# EAGLE design bridge-1A (EAGLE 7.7.0)

## Sheet 1 of 2
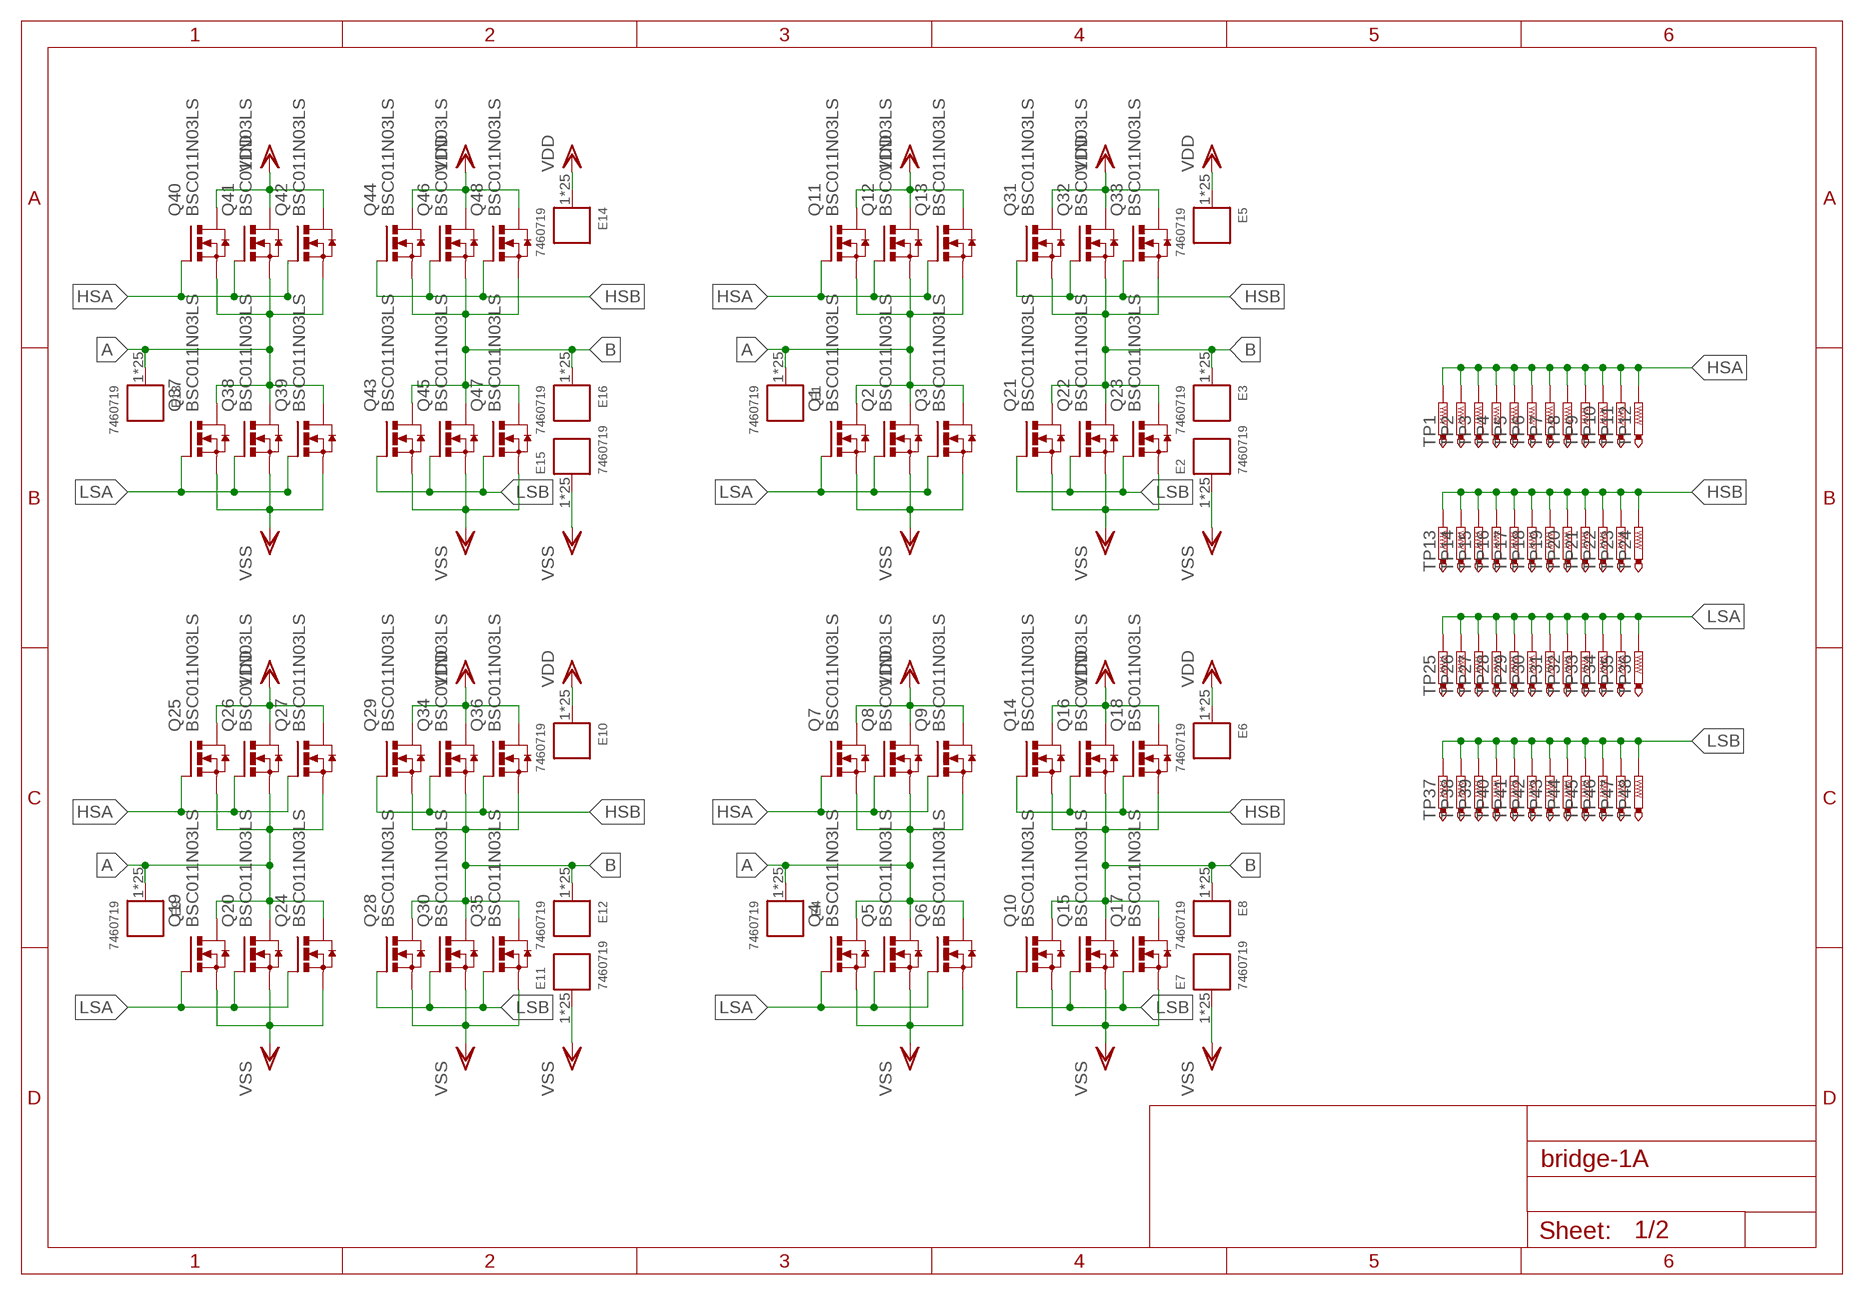
[diagram p0: schematic, sheet 1]

### Parts
E1  7460719  WP-SHFU_K(HAL)  [25PINS_FULL_HAL]
E2  7460719  WP-SHFU_K(HAL)  [25PINS_FULL_HAL]
E3  7460719  WP-SHFU_K(HAL)  [25PINS_FULL_HAL]
E4  7460719  WP-SHFU_K(HAL)  [25PINS_FULL_HAL]
E5  7460719  WP-SHFU_K(HAL)  [25PINS_FULL_HAL]
E6  7460719  WP-SHFU_K(HAL)  [25PINS_FULL_HAL]
E7  7460719  WP-SHFU_K(HAL)  [25PINS_FULL_HAL]
E8  7460719  WP-SHFU_K(HAL)  [25PINS_FULL_HAL]
E9  7460719  WP-SHFU_K(HAL)  [25PINS_FULL_HAL]
E10  7460719  WP-SHFU_K(HAL)  [25PINS_FULL_HAL]
E11  7460719  WP-SHFU_K(HAL)  [25PINS_FULL_HAL]
E12  7460719  WP-SHFU_K(HAL)  [25PINS_FULL_HAL]
E13  7460719  WP-SHFU_K(HAL)  [25PINS_FULL_HAL]
E14  7460719  WP-SHFU_K(HAL)  [25PINS_FULL_HAL]
E15  7460719  WP-SHFU_K(HAL)  [25PINS_FULL_HAL]
E16  7460719  WP-SHFU_K(HAL)  [25PINS_FULL_HAL]
Q1  BSC011N03LS  [PG-TDSON-8]
Q2  BSC011N03LS  [PG-TDSON-8]
Q3  BSC011N03LS  [PG-TDSON-8]
Q4  BSC011N03LS  [PG-TDSON-8]
Q5  BSC011N03LS  [PG-TDSON-8]
Q6  BSC011N03LS  [PG-TDSON-8]
Q7  BSC011N03LS  [PG-TDSON-8]
Q8  BSC011N03LS  [PG-TDSON-8]
Q9  BSC011N03LS  [PG-TDSON-8]
Q10  BSC011N03LS  [PG-TDSON-8]
Q11  BSC011N03LS  [PG-TDSON-8]
Q12  BSC011N03LS  [PG-TDSON-8]
Q13  BSC011N03LS  [PG-TDSON-8]
Q14  BSC011N03LS  [PG-TDSON-8]
Q15  BSC011N03LS  [PG-TDSON-8]
Q16  BSC011N03LS  [PG-TDSON-8]
Q17  BSC011N03LS  [PG-TDSON-8]
Q18  BSC011N03LS  [PG-TDSON-8]
Q19  BSC011N03LS  [PG-TDSON-8]
Q20  BSC011N03LS  [PG-TDSON-8]
Q21  BSC011N03LS  [PG-TDSON-8]
Q22  BSC011N03LS  [PG-TDSON-8]
Q23  BSC011N03LS  [PG-TDSON-8]
Q24  BSC011N03LS  [PG-TDSON-8]
Q25  BSC011N03LS  [PG-TDSON-8]
Q26  BSC011N03LS  [PG-TDSON-8]
Q27  BSC011N03LS  [PG-TDSON-8]
Q28  BSC011N03LS  [PG-TDSON-8]
Q29  BSC011N03LS  [PG-TDSON-8]
Q30  BSC011N03LS  [PG-TDSON-8]
Q31  BSC011N03LS  [PG-TDSON-8]
Q32  BSC011N03LS  [PG-TDSON-8]
Q33  BSC011N03LS  [PG-TDSON-8]
Q34  BSC011N03LS  [PG-TDSON-8]
Q35  BSC011N03LS  [PG-TDSON-8]
Q36  BSC011N03LS  [PG-TDSON-8]
Q37  BSC011N03LS  [PG-TDSON-8]
Q38  BSC011N03LS  [PG-TDSON-8]
Q39  BSC011N03LS  [PG-TDSON-8]
Q40  BSC011N03LS  [PG-TDSON-8]
Q41  BSC011N03LS  [PG-TDSON-8]
Q42  BSC011N03LS  [PG-TDSON-8]
Q43  BSC011N03LS  [PG-TDSON-8]
Q44  BSC011N03LS  [PG-TDSON-8]
Q45  BSC011N03LS  [PG-TDSON-8]
Q46  BSC011N03LS  [PG-TDSON-8]
Q47  BSC011N03LS  [PG-TDSON-8]
Q48  BSC011N03LS  [PG-TDSON-8]
TP1  PTR1TP12SQ  [TP12SQ]
TP2  PTR1TP12SQ  [TP12SQ]
TP3  PTR1TP12SQ  [TP12SQ]
TP4  PTR1TP12SQ  [TP12SQ]
TP5  PTR1TP12SQ  [TP12SQ]
TP6  PTR1TP12SQ  [TP12SQ]
TP7  PTR1TP12SQ  [TP12SQ]
TP8  PTR1TP12SQ  [TP12SQ]
TP9  PTR1TP12SQ  [TP12SQ]
TP10  PTR1TP12SQ  [TP12SQ]
TP11  PTR1TP12SQ  [TP12SQ]
TP12  PTR1TP12SQ  [TP12SQ]
TP13  PTR1TP12SQ  [TP12SQ]
TP14  PTR1TP12SQ  [TP12SQ]
TP15  PTR1TP12SQ  [TP12SQ]
TP16  PTR1TP12SQ  [TP12SQ]
TP17  PTR1TP12SQ  [TP12SQ]
TP18  PTR1TP12SQ  [TP12SQ]
TP19  PTR1TP12SQ  [TP12SQ]
TP20  PTR1TP12SQ  [TP12SQ]
TP21  PTR1TP12SQ  [TP12SQ]
TP22  PTR1TP12SQ  [TP12SQ]
TP23  PTR1TP12SQ  [TP12SQ]
TP24  PTR1TP12SQ  [TP12SQ]
TP25  PTR1TP12SQ  [TP12SQ]
TP26  PTR1TP12SQ  [TP12SQ]
TP27  PTR1TP12SQ  [TP12SQ]
TP28  PTR1TP12SQ  [TP12SQ]
TP29  PTR1TP12SQ  [TP12SQ]
TP30  PTR1TP12SQ  [TP12SQ]
TP31  PTR1TP12SQ  [TP12SQ]
TP32  PTR1TP12SQ  [TP12SQ]
TP33  PTR1TP12SQ  [TP12SQ]
TP34  PTR1TP12SQ  [TP12SQ]
TP35  PTR1TP12SQ  [TP12SQ]
TP36  PTR1TP12SQ  [TP12SQ]
TP37  PTR1TP12SQ  [TP12SQ]
TP38  PTR1TP12SQ  [TP12SQ]
TP39  PTR1TP12SQ  [TP12SQ]
TP40  PTR1TP12SQ  [TP12SQ]
TP41  PTR1TP12SQ  [TP12SQ]
TP42  PTR1TP12SQ  [TP12SQ]
TP43  PTR1TP12SQ  [TP12SQ]
TP44  PTR1TP12SQ  [TP12SQ]
TP45  PTR1TP12SQ  [TP12SQ]
TP46  PTR1TP12SQ  [TP12SQ]
TP47  PTR1TP12SQ  [TP12SQ]
TP48  PTR1TP12SQ  [TP12SQ]

### Nets
A: E1.1 E1.2 E1.3 E1.4 E1.5 E1.6 E1.7 E1.8 E1.9 E1.10 E1.11 E1.12 E1.13 E1.14 E1.15 E1.16 E1.17 E1.18 E1.19 E1.20 E1.21 E1.22 E1.23 E1.24 E1.25 E4.1 E4.2 E4.3 E4.4 E4.5 E4.6 E4.7 E4.8 E4.9 E4.10 E4.11 E4.12 E4.13 E4.14 E4.15 E4.16 E4.17 E4.18 E4.19 E4.20 E4.21 E4.22 E4.23 E4.24 E4.25 E9.1 E9.2 E9.3 E9.4 E9.5 E9.6 E9.7 E9.8 E9.9 E9.10 E9.11 E9.12 E9.13 E9.14 E9.15 E9.16 E9.17 E9.18 E9.19 E9.20 E9.21 E9.22 E9.23 E9.24 E9.25 E13.1 E13.2 E13.3 E13.4 E13.5 E13.6 E13.7 E13.8 E13.9 E13.10 E13.11 E13.12 E13.13 E13.14 E13.15 E13.16 E13.17 E13.18 E13.19 E13.20 E13.21 E13.22 E13.23 E13.24 E13.25 Q1.5(D) Q1.6(D) Q1.7(D) Q1.8(D) Q1.TH(D) Q2.5(D) Q2.6(D) Q2.7(D) Q2.8(D) Q2.TH(D) Q3.5(D) Q3.6(D) Q3.7(D) Q3.8(D) Q3.TH(D) Q4.5(D) Q4.6(D) Q4.7(D) Q4.8(D) Q4.TH(D) Q5.5(D) Q5.6(D) Q5.7(D) Q5.8(D) Q5.TH(D) Q6.5(D) Q6.6(D) Q6.7(D) Q6.8(D) Q6.TH(D) Q7.1(S) Q7.2(S) Q7.3(S) Q8.1(S) Q8.2(S) Q8.3(S) Q9.1(S) Q9.2(S) Q9.3(S) Q11.1(S) Q11.2(S) Q11.3(S) Q12.1(S) Q12.2(S) Q12.3(S) Q13.1(S) Q13.2(S) Q13.3(S) Q19.5(D) Q19.6(D) Q19.7(D) Q19.8(D) Q19.TH(D) Q20.5(D) Q20.6(D) Q20.7(D) Q20.8(D) Q20.TH(D) Q24.5(D) Q24.6(D) Q24.7(D) Q24.8(D) Q24.TH(D) Q25.1(S) Q25.2(S) Q25.3(S) Q26.1(S) Q26.2(S) Q26.3(S) Q27.1(S) Q27.2(S) Q27.3(S) Q37.5(D) Q37.6(D) Q37.7(D) Q37.8(D) Q37.TH(D) Q38.5(D) Q38.6(D) Q38.7(D) Q38.8(D) Q38.TH(D) Q39.5(D) Q39.6(D) Q39.7(D) Q39.8(D) Q39.TH(D) Q40.1(S) Q40.2(S) Q40.3(S) Q41.1(S) Q41.2(S) Q41.3(S) Q42.1(S) Q42.2(S) Q42.3(S)
B: E3.1 E3.2 E3.3 E3.4 E3.5 E3.6 E3.7 E3.8 E3.9 E3.10 E3.11 E3.12 E3.13 E3.14 E3.15 E3.16 E3.17 E3.18 E3.19 E3.20 E3.21 E3.22 E3.23 E3.24 E3.25 E8.1 E8.2 E8.3 E8.4 E8.5 E8.6 E8.7 E8.8 E8.9 E8.10 E8.11 E8.12 E8.13 E8.14 E8.15 E8.16 E8.17 E8.18 E8.19 E8.20 E8.21 E8.22 E8.23 E8.24 E8.25 E12.1 E12.2 E12.3 E12.4 E12.5 E12.6 E12.7 E12.8 E12.9 E12.10 E12.11 E12.12 E12.13 E12.14 E12.15 E12.16 E12.17 E12.18 E12.19 E12.20 E12.21 E12.22 E12.23 E12.24 E12.25 E16.1 E16.2 E16.3 E16.4 E16.5 E16.6 E16.7 E16.8 E16.9 E16.10 E16.11 E16.12 E16.13 E16.14 E16.15 E16.16 E16.17 E16.18 E16.19 E16.20 E16.21 E16.22 E16.23 E16.24 E16.25 Q10.5(D) Q10.6(D) Q10.7(D) Q10.8(D) Q10.TH(D) Q14.1(S) Q14.2(S) Q14.3(S) Q15.5(D) Q15.6(D) Q15.7(D) Q15.8(D) Q15.TH(D) Q16.1(S) Q16.2(S) Q16.3(S) Q17.5(D) Q17.6(D) Q17.7(D) Q17.8(D) Q17.TH(D) Q18.1(S) Q18.2(S) Q18.3(S) Q21.5(D) Q21.6(D) Q21.7(D) Q21.8(D) Q21.TH(D) Q22.5(D) Q22.6(D) Q22.7(D) Q22.8(D) Q22.TH(D) Q23.5(D) Q23.6(D) Q23.7(D) Q23.8(D) Q23.TH(D) Q28.5(D) Q28.6(D) Q28.7(D) Q28.8(D) Q28.TH(D) Q29.1(S) Q29.2(S) Q29.3(S) Q30.5(D) Q30.6(D) Q30.7(D) Q30.8(D) Q30.TH(D) Q31.1(S) Q31.2(S) Q31.3(S) Q32.1(S) Q32.2(S) Q32.3(S) Q33.1(S) Q33.2(S) Q33.3(S) Q34.1(S) Q34.2(S) Q34.3(S) Q35.5(D) Q35.6(D) Q35.7(D) Q35.8(D) Q35.TH(D) Q36.1(S) Q36.2(S) Q36.3(S) Q43.5(D) Q43.6(D) Q43.7(D) Q43.8(D) Q43.TH(D) Q44.1(S) Q44.2(S) Q44.3(S) Q45.5(D) Q45.6(D) Q45.7(D) Q45.8(D) Q45.TH(D) Q46.1(S) Q46.2(S) Q46.3(S) Q47.5(D) Q47.6(D) Q47.7(D) Q47.8(D) Q47.TH(D) Q48.1(S) Q48.2(S) Q48.3(S)
HSA: Q7.4(G) Q8.4(G) Q9.4(G) Q11.4(G) Q12.4(G) Q13.4(G) Q25.4(G) Q26.4(G) Q27.4(G) Q40.4(G) Q41.4(G) Q42.4(G) TP1.TP TP2.TP TP3.TP TP4.TP TP5.TP TP6.TP TP7.TP TP8.TP TP9.TP TP10.TP TP11.TP TP12.TP
HSB: Q14.4(G) Q16.4(G) Q18.4(G) Q29.4(G) Q31.4(G) Q32.4(G) Q33.4(G) Q34.4(G) Q36.4(G) Q44.4(G) Q46.4(G) Q48.4(G) TP13.TP TP14.TP TP15.TP TP16.TP TP17.TP TP18.TP TP19.TP TP20.TP TP21.TP TP22.TP TP23.TP TP24.TP
LSA: Q1.4(G) Q2.4(G) Q3.4(G) Q4.4(G) Q5.4(G) Q6.4(G) Q19.4(G) Q20.4(G) Q24.4(G) Q37.4(G) Q38.4(G) Q39.4(G) TP25.TP TP26.TP TP27.TP TP28.TP TP29.TP TP30.TP TP31.TP TP32.TP TP33.TP TP34.TP TP35.TP TP36.TP
LSB: Q10.4(G) Q15.4(G) Q17.4(G) Q21.4(G) Q22.4(G) Q23.4(G) Q28.4(G) Q30.4(G) Q35.4(G) Q43.4(G) Q45.4(G) Q47.4(G) TP37.TP TP38.TP TP39.TP TP40.TP TP41.TP TP42.TP TP43.TP TP44.TP TP45.TP TP46.TP TP47.TP TP48.TP
VDD: E5.1 E5.2 E5.3 E5.4 E5.5 E5.6 E5.7 E5.8 E5.9 E5.10 E5.11 E5.12 E5.13 E5.14 E5.15 E5.16 E5.17 E5.18 E5.19 E5.20 E5.21 E5.22 E5.23 E5.24 E5.25 E6.1 E6.2 E6.3 E6.4 E6.5 E6.6 E6.7 E6.8 E6.9 E6.10 E6.11 E6.12 E6.13 E6.14 E6.15 E6.16 E6.17 E6.18 E6.19 E6.20 E6.21 E6.22 E6.23 E6.24 E6.25 E10.1 E10.2 E10.3 E10.4 E10.5 E10.6 E10.7 E10.8 E10.9 E10.10 E10.11 E10.12 E10.13 E10.14 E10.15 E10.16 E10.17 E10.18 E10.19 E10.20 E10.21 E10.22 E10.23 E10.24 E10.25 E14.1 E14.2 E14.3 E14.4 E14.5 E14.6 E14.7 E14.8 E14.9 E14.10 E14.11 E14.12 E14.13 E14.14 E14.15 E14.16 E14.17 E14.18 E14.19 E14.20 E14.21 E14.22 E14.23 E14.24 E14.25 Q7.5(D) Q7.6(D) Q7.7(D) Q7.8(D) Q7.TH(D) Q8.5(D) Q8.6(D) Q8.7(D) Q8.8(D) Q8.TH(D) Q9.5(D) Q9.6(D) Q9.7(D) Q9.8(D) Q9.TH(D) Q11.5(D) Q11.6(D) Q11.7(D) Q11.8(D) Q11.TH(D) Q12.5(D) Q12.6(D) Q12.7(D) Q12.8(D) Q12.TH(D) Q13.5(D) Q13.6(D) Q13.7(D) Q13.8(D) Q13.TH(D) Q14.5(D) Q14.6(D) Q14.7(D) Q14.8(D) Q14.TH(D) Q16.5(D) Q16.6(D) Q16.7(D) Q16.8(D) Q16.TH(D) Q18.5(D) Q18.6(D) Q18.7(D) Q18.8(D) Q18.TH(D) Q25.5(D) Q25.6(D) Q25.7(D) Q25.8(D) Q25.TH(D) Q26.5(D) Q26.6(D) Q26.7(D) Q26.8(D) Q26.TH(D) Q27.5(D) Q27.6(D) Q27.7(D) Q27.8(D) Q27.TH(D) Q29.5(D) Q29.6(D) Q29.7(D) Q29.8(D) Q29.TH(D) Q31.5(D) Q31.6(D) Q31.7(D) Q31.8(D) Q31.TH(D) Q32.5(D) Q32.6(D) Q32.7(D) Q32.8(D) Q32.TH(D) Q33.5(D) Q33.6(D) Q33.7(D) Q33.8(D) Q33.TH(D) Q34.5(D) Q34.6(D) Q34.7(D) Q34.8(D) Q34.TH(D) Q36.5(D) Q36.6(D) Q36.7(D) Q36.8(D) Q36.TH(D) Q40.5(D) Q40.6(D) Q40.7(D) Q40.8(D) Q40.TH(D) Q41.5(D) Q41.6(D) Q41.7(D) Q41.8(D) Q41.TH(D) Q42.5(D) Q42.6(D) Q42.7(D) Q42.8(D) Q42.TH(D) Q44.5(D) Q44.6(D) Q44.7(D) Q44.8(D) Q44.TH(D) Q46.5(D) Q46.6(D) Q46.7(D) Q46.8(D) Q46.TH(D) Q48.5(D) Q48.6(D) Q48.7(D) Q48.8(D) Q48.TH(D)
VSS: E2.1 E2.2 E2.3 E2.4 E2.5 E2.6 E2.7 E2.8 E2.9 E2.10 E2.11 E2.12 E2.13 E2.14 E2.15 E2.16 E2.17 E2.18 E2.19 E2.20 E2.21 E2.22 E2.23 E2.24 E2.25 E7.1 E7.2 E7.3 E7.4 E7.5 E7.6 E7.7 E7.8 E7.9 E7.10 E7.11 E7.12 E7.13 E7.14 E7.15 E7.16 E7.17 E7.18 E7.19 E7.20 E7.21 E7.22 E7.23 E7.24 E7.25 E11.1 E11.2 E11.3 E11.4 E11.5 E11.6 E11.7 E11.8 E11.9 E11.10 E11.11 E11.12 E11.13 E11.14 E11.15 E11.16 E11.17 E11.18 E11.19 E11.20 E11.21 E11.22 E11.23 E11.24 E11.25 E15.1 E15.2 E15.3 E15.4 E15.5 E15.6 E15.7 E15.8 E15.9 E15.10 E15.11 E15.12 E15.13 E15.14 E15.15 E15.16 E15.17 E15.18 E15.19 E15.20 E15.21 E15.22 E15.23 E15.24 E15.25 Q1.1(S) Q1.2(S) Q1.3(S) Q2.1(S) Q2.2(S) Q2.3(S) Q3.1(S) Q3.2(S) Q3.3(S) Q4.1(S) Q4.2(S) Q4.3(S) Q5.1(S) Q5.2(S) Q5.3(S) Q6.1(S) Q6.2(S) Q6.3(S) Q10.1(S) Q10.2(S) Q10.3(S) Q15.1(S) Q15.2(S) Q15.3(S) Q17.1(S) Q17.2(S) Q17.3(S) Q19.1(S) Q19.2(S) Q19.3(S) Q20.1(S) Q20.2(S) Q20.3(S) Q21.1(S) Q21.2(S) Q21.3(S) Q22.1(S) Q22.2(S) Q22.3(S) Q23.1(S) Q23.2(S) Q23.3(S) Q24.1(S) Q24.2(S) Q24.3(S) Q28.1(S) Q28.2(S) Q28.3(S) Q30.1(S) Q30.2(S) Q30.3(S) Q35.1(S) Q35.2(S) Q35.3(S) Q37.1(S) Q37.2(S) Q37.3(S) Q38.1(S) Q38.2(S) Q38.3(S) Q39.1(S) Q39.2(S) Q39.3(S) Q43.1(S) Q43.2(S) Q43.3(S) Q45.1(S) Q45.2(S) Q45.3(S) Q47.1(S) Q47.2(S) Q47.3(S)

## Sheet 2 of 2

## Library data of the parts
E1-E16 = Wuerth_Elektronik_Power_Elements_rev15c:WP-SHFU: Threaded shank with full plain Pin-Plate Characteristics Drill hole diameter:1.60(-0.03)mm Final hole diameter for HAL surface:1.45(+/-0.05)mm forchemical tin:1.475(+/-0.05)mm Min. layer thickness of copper in the via:25UM Max.layer thickness of tin in the via:15UM MATERIAL:CuZn39Pb3 Variant abbreviation FULL means Threaded shank with full plain Pin-Plate J,K,L,I means Format Type HAL means Land pattern for HAL <http://katalog.we-online.de/media/images/v2/Family_WP-SHFU.jpg> Details see: http://katalog.we-online.de/en/em/Powerelemente_mit_Gewindestift_vollflaechig/7461094?m 2015 (C) Wurth Elektronik; FAMILY: WP-SHFU; INFO: 250 Amp M8 Terminal; MFG: WUERTHELEKTRONIK; MF_PARTNO: 7460719; MOUSER: 710-7460719
Q1-Q48 = custom-parts:BSC011N03LS: OptiMOSTM Power-MOSFET Datasheet: https://www.infineon.com/dgdl/Infineon-BSC011N03LS-DS-v02_02-en.pdf?fileId=db3a30432c64a60d012cbb2c20ff02a0
TP1-TP48 = testpad:PTR1: TEST PIN

## Net classes
0 default: clearance 0.508 mm

## Board
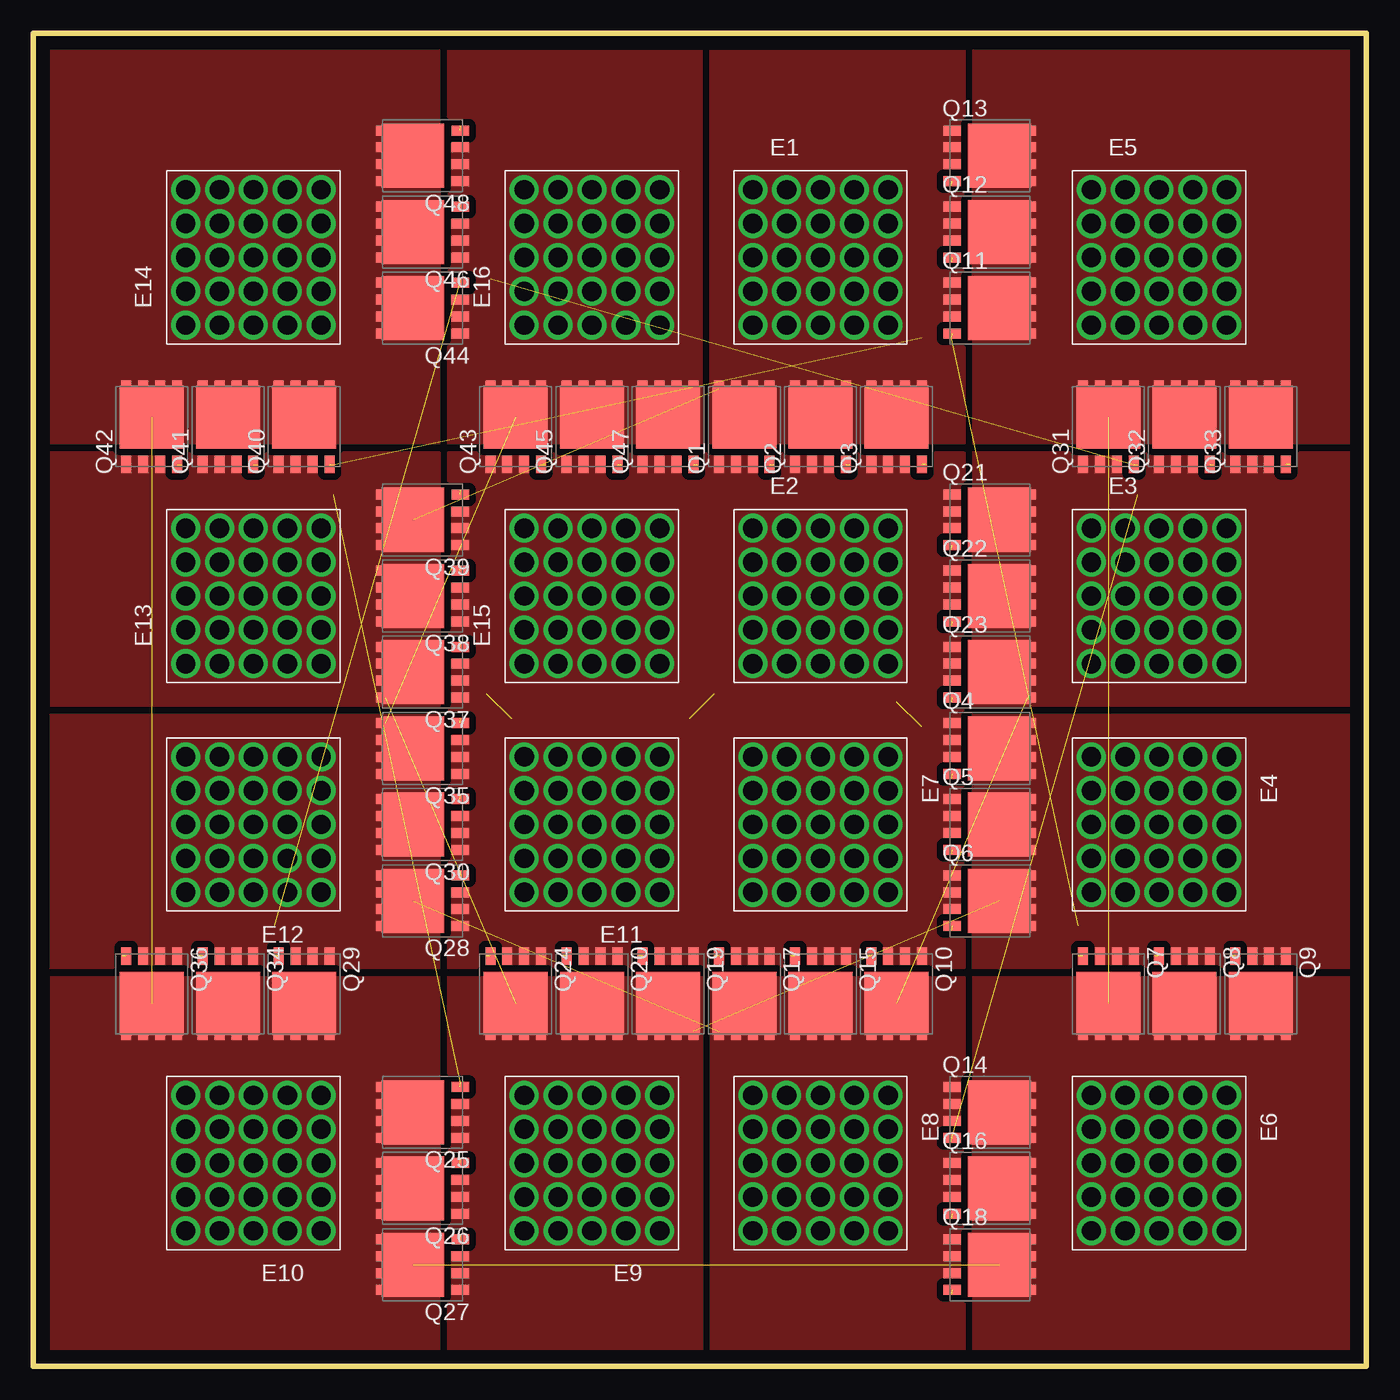
[diagram p1: board, top side]
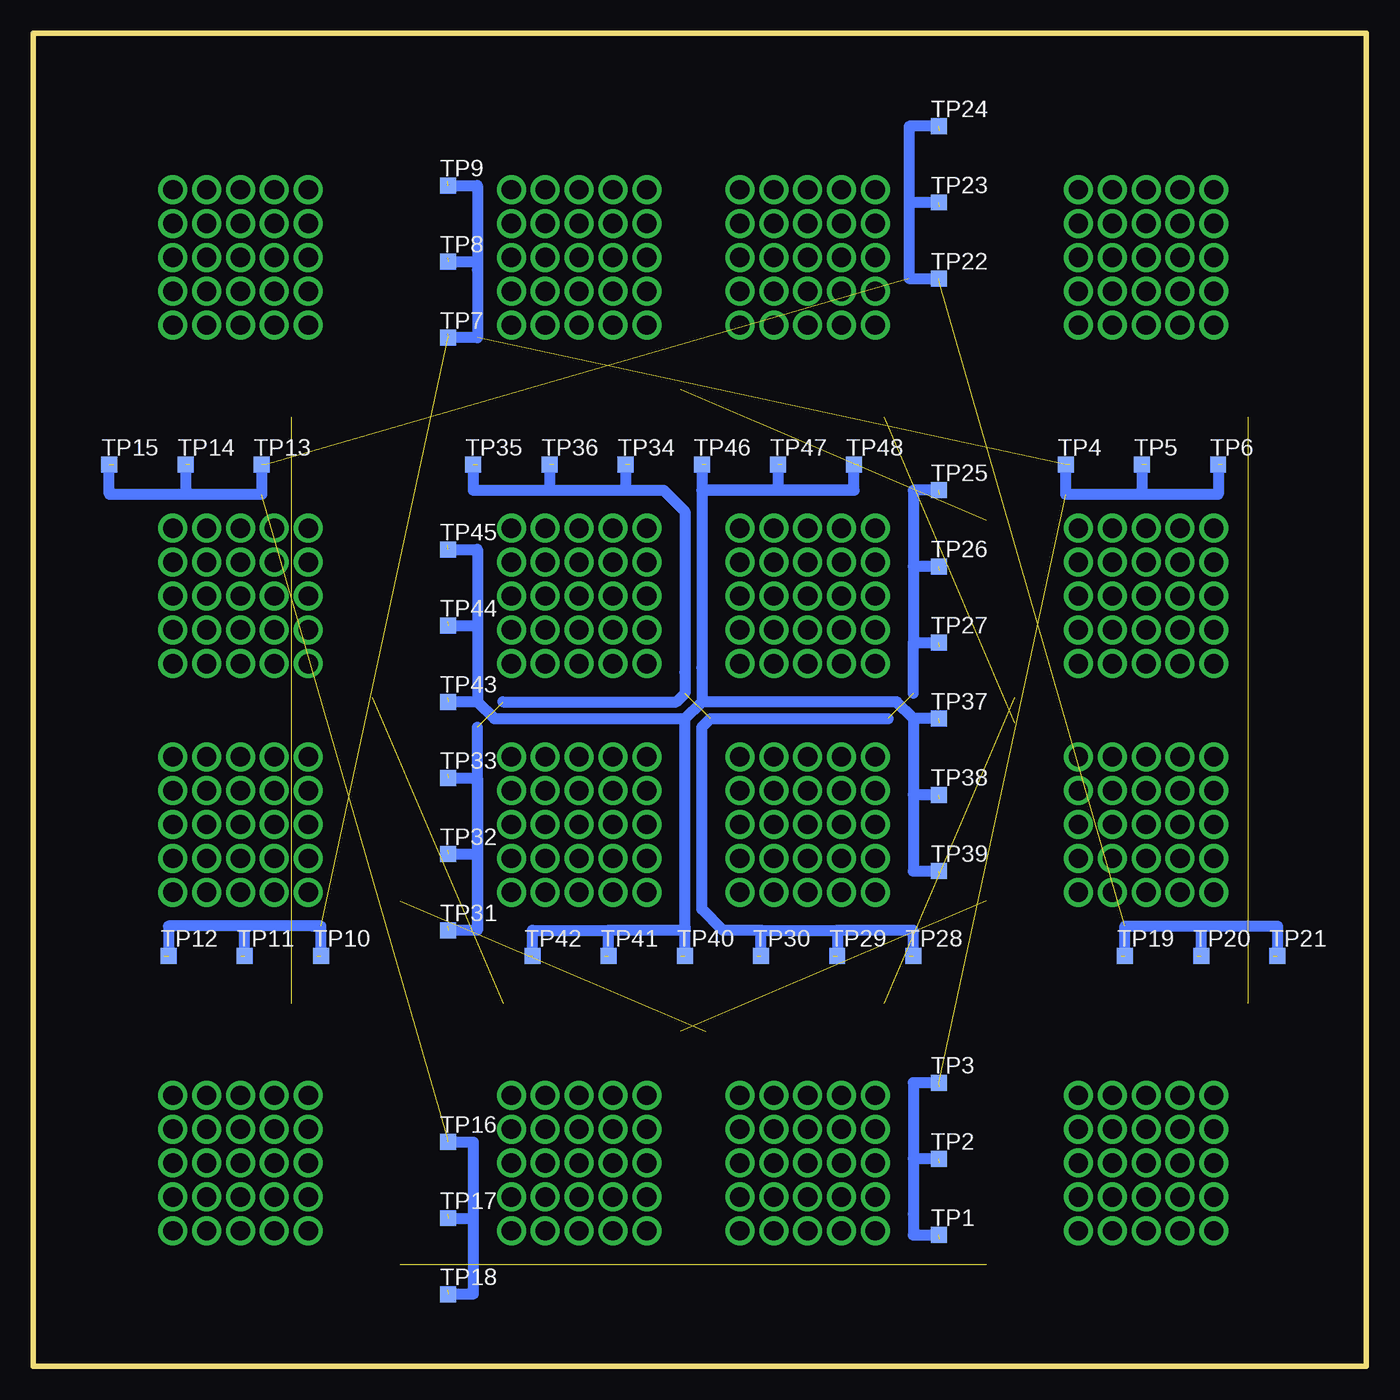
[diagram p2: board, bottom side, seen from below]

Size 100 x 100 mm. Coordinates in mm from the lower left corner, seen from the top.
Outline: 0,0 0,100 100,100 100,0 0,0
Copper layers (1*16): Top 0.035mm / dielectric 1.5mm / Bottom 0.035mm
Design rules "default": minimum track width 10mil, minimum drill 24mil, track to track 8mil, track to pad 8mil, pad to pad 8mil, via to via 8mil, smd to smd 8mil, copper to edge 40mil, drill to drill 8mil, minimum pad ring 10mil, minimum via ring 8mil, stop-mask expansion 4mil, vias tented up to drill 0mil, thermal gap 10mil

### Footprints (pad centres in the part's own frame; a part is rotated, then mirrored left to right if it is on the bottom)
25PINS_FULL_HAL = drill 1.45: 1 -5.08,5.08; 2 -2.54,5.08; 3 0,5.08; 4 2.54,5.08; 5 5.08,5.08; 6 5.08,2.54; 7 2.54,2.54; 8 0,2.54; 9 -2.54,2.54; 10 -5.08,2.54; 11 -5.08,0; 12 -2.54,0; 13 0,0; 14 2.54,0; 15 5.08,0; 16 5.08,-2.54; 17 2.54,-2.54; 18 0,-2.54; 19 -2.54,-2.54; 20 -5.08,-2.54; 21 -5.08,-5.08; 22 -2.54,-5.08; 23 0,-5.08; 24 2.54,-5.08; 25 5.08,-5.08
PG-TDSON-8 = smd 1.3 x 0.75: 1 -2.825,1.905; 2 -2.825,0.635; 3 -2.825,-0.635; 4 -2.825,-1.905; 5 2.825,-1.905; 6 2.825,-0.635; 7 2.825,0.635; 8 2.825,1.905 | smd 4.7 x 4.8: TH 0.725,0
TP12SQ = smd 1.2 x 1.2: TP 0,0

### Placement (x,y rotation side)
E1  59.05,83.19 0 top
E2  59.05,57.78 0 top
E3  84.45,57.78 0 top
E4  84.45,40.64 270 top
E5  84.45,83.19 0 top
E6  84.45,15.24 270 top
E7  59.05,40.64 270 top
E8  59.05,15.24 270 top
E9  41.91,15.24 180 top
E10  16.51,15.24 180 top
E11  41.91,40.64 180 top
E12  16.51,40.64 180 top
E13  16.51,57.78 90 top
E14  16.51,83.19 90 top
E15  41.91,57.78 90 top
E16  41.91,83.19 90 top
Q1  53.34,70.48 90 top
Q2  59.05,70.48 90 top
Q3  64.77,70.48 90 top
Q4  71.75,46.35 0 top
Q5  71.75,40.64 0 top
Q6  71.75,34.92 0 top
Q7  80.64,27.94 270 top
Q8  86.36,27.94 270 top
Q9  92.08,27.94 270 top
Q10  64.77,27.94 270 top
Q11  71.75,79.38 0 top
Q12  71.75,85.09 0 top
Q13  71.75,90.81 0 top
Q14  71.75,19.05 0 top
Q15  59.05,27.94 270 top
Q16  71.75,13.34 0 top
Q17  53.34,27.94 270 top
Q18  71.75,7.62 0 top
Q19  47.62,27.94 270 top
Q20  41.91,27.94 270 top
Q21  71.75,63.5 0 top
Q22  71.75,57.78 0 top
Q23  71.75,52.07 0 top
Q24  36.2,27.94 270 top
Q25  29.21,19.05 180 top
Q26  29.21,13.34 180 top
Q27  29.21,7.62 180 top
Q28  29.21,34.92 180 top
Q29  20.32,27.94 270 top
Q30  29.21,40.64 180 top
Q31  80.64,70.48 90 top
Q32  86.36,70.48 90 top
Q33  92.08,70.48 90 top
Q34  14.61,27.94 270 top
Q35  29.21,46.35 180 top
Q36  8.89,27.94 270 top
Q37  29.21,52.07 180 top
Q38  29.21,57.78 180 top
Q39  29.21,63.5 180 top
Q40  20.32,70.48 90 top
Q41  14.61,70.48 90 top
Q42  8.89,70.48 90 top
Q43  36.2,70.48 90 top
Q44  29.21,79.38 180 top
Q45  41.91,70.48 90 top
Q46  29.21,85.09 180 top
Q47  47.62,70.48 90 top
Q48  29.21,90.81 180 top
TP1  32.07,9.84 0 bottom
TP2  32.07,15.56 0 bottom
TP3  32.07,21.27 0 bottom
TP4  22.54,67.63 0 bottom
TP5  16.83,67.63 0 bottom
TP6  11.11,67.63 0 bottom
TP7  68.9,77.15 0 bottom
TP8  68.9,82.87 0 bottom
TP9  68.9,88.58 0 bottom
TP10  78.42,30.8 0 bottom
TP11  84.14,30.8 0 bottom
TP12  89.85,30.8 0 bottom
TP13  82.87,67.63 0 bottom
TP14  88.58,67.63 0 bottom
TP15  94.3,67.63 0 bottom
TP16  68.9,16.83 0 bottom
TP17  68.9,11.11 0 bottom
TP18  68.9,5.4 0 bottom
TP19  18.1,30.8 0 bottom
TP20  12.38,30.8 0 bottom
TP21  6.67,30.8 0 bottom
TP22  32.07,81.6 0 bottom
TP23  32.07,87.31 0 bottom
TP24  32.07,93.03 0 bottom
TP25  32.07,65.72 0 bottom
TP26  32.07,60.01 0 bottom
TP27  32.07,54.29 0 bottom
TP28  33.97,30.8 0 bottom
TP29  39.69,30.8 0 bottom
TP30  45.4,30.8 0 bottom
TP31  68.9,32.7 0 bottom
TP32  68.9,38.42 0 bottom
TP33  68.9,44.13 0 bottom
TP34  55.56,67.63 0 bottom
TP35  66.99,67.63 0 bottom
TP36  61.28,67.63 0 bottom
TP37  32.07,48.58 0 bottom
TP38  32.07,42.86 0 bottom
TP39  32.07,37.15 0 bottom
TP40  51.12,30.8 0 bottom
TP41  56.83,30.8 0 bottom
TP42  62.55,30.8 0 bottom
TP43  68.9,49.85 0 bottom
TP44  68.9,55.56 0 bottom
TP45  68.9,61.28 0 bottom
TP46  49.85,67.63 0 bottom
TP47  44.13,67.63 0 bottom
TP48  38.42,67.63 0 bottom

### Tracks (layer width: path | path; a pad name or v marks a point on that pad's centre or on a via)
A  (3 unrouted)
  pour Top (no thermals): 71.12,48.9 100.33,48.9 100.33,29.84 70.48,29.84 70.48,48.9
  pour Top (no thermals): 50.8,69.85 50.8,99.06 69.85,99.06 69.85,69.22 50.8,69.22
  pour Top (no thermals): 29.84,49.53 0.64,49.53 0.64,68.58 30.48,68.58 30.48,49.53
  pour Top (no thermals): 50.16,28.57 50.16,-0.64 31.11,-0.64 31.11,29.21 50.16,29.21
B  (3 unrouted)
  pour Top (rank 2, no thermals): 71.12,68.58 100.33,68.58 100.33,49.53 70.48,49.53 70.48,68.58
  pour Top (rank 2, no thermals): 31.11,69.85 31.11,99.06 50.16,99.06 50.16,69.22 31.11,69.22
  pour Top (rank 2, no thermals): 30.48,29.84 0,29.84 0,48.9 30.48,48.9
  pour Top (rank 2, no thermals): 69.85,28.57 69.85,-0.64 50.8,-0.64 50.8,29.21 69.85,29.21
HSA  (15 unrouted)
  Bottom 0.813: TP3.TP 33.97,21.27 33.97,15.56 | 33.97,15.56 33.97,11.43 33.97,9.84 TP1.TP | TP2.TP 33.97,15.56 | TP10.TP 78.42,33.02 79.06,33.02 84.14,33.02 | 84.14,33.02 89.85,33.02 TP12.TP | TP11.TP 84.14,33.02 | TP6.TP 11.11,65.41 16.83,65.41 | 16.83,65.41 18.73,65.41 22.54,65.41 TP4.TP | TP5.TP 16.83,65.41 | TP9.TP 66.67,88.58 66.67,82.87 | 66.67,82.87 66.67,82.23 66.67,77.15 TP7.TP | TP8.TP 66.67,82.87
HSB  (15 unrouted)
  Bottom 0.813: TP16.TP 66.99,16.83 66.99,11.11 | 66.99,11.11 66.99,7.3 66.99,5.4 TP18.TP | TP17.TP 66.99,11.11 | TP13.TP 82.87,65.41 88.9,65.41 | 88.9,65.41 92.08,65.41 94.3,65.41 TP15.TP | TP14.TP 88.58,65.41 88.9,65.41 | TP19.TP 18.1,33.02 16.83,33.02 12.38,33.02 | 12.38,33.02 6.67,33.02 TP21.TP | TP20.TP 12.38,33.02 | TP24.TP 34.29,93.03 34.29,86.36 | 34.29,86.36 34.29,83.5 34.29,81.6 TP22.TP | TP23.TP 34.29,87.31 34.29,86.36
LSA  (15 unrouted)
  Bottom 0.813: TP28.TP 33.97,32.7 39.69,32.7 | 39.69,32.7 TP29.TP | 45.4,32.7 TP30.TP 45.4,32.7 | 45.4,32.7 39.69,32.7 | TP35.TP 66.99,65.72 61.28,65.72 | 61.28,65.72 55.56,65.72 | TP34.TP 55.56,65.72 | TP36.TP 61.28,65.72 | TP25.TP 33.97,65.72 33.97,60.01 | 33.97,60.01 33.97,54.29 | 33.97,54.29 TP27.TP | TP26.TP 33.97,60.01 | TP33.TP 66.67,44.13 | 66.67,44.13 66.67,38.42 | 66.67,38.42 66.67,32.7 | 66.67,32.7 TP31.TP | TP32.TP 66.67,38.42 | 45.4,32.7 48.26,32.7 49.85,34.29 49.85,47.94 49.21,48.58 35.88,48.58 | 33.97,50.48 33.97,54.29 | 55.56,65.72 52.7,65.72 51.12,64.14 51.12,52.07 51.12,50.48 51.75,49.85 64.77,49.85 | 66.67,32.7 66.67,38.42 | 66.67,38.42 66.67,44.13 | 66.67,44.13 66.67,47.94
LSB  (12 unrouted)
  Bottom 0.813: TP40.TP 51.12,32.7 | 51.12,32.7 56.83,32.7 | TP41.TP 56.83,32.7 | TP42.TP 62.55,32.7 56.83,32.7 | TP37.TP 33.97,48.58 | 33.97,48.58 33.97,42.86 | 33.97,42.86 33.97,37.15 TP39.TP | TP38.TP 33.97,42.86 | TP46.TP 49.85,65.72 | 49.85,65.72 44.13,65.72 | 44.13,65.72 38.42,65.72 | 38.42,65.72 TP48.TP | TP47.TP 44.13,65.72 | TP45.TP 66.67,61.28 66.67,55.56 | 66.67,55.56 66.67,49.85 | 66.67,49.85 TP43.TP | TP44.TP 66.67,55.56 | 33.97,48.58 35.24,49.85 49.85,49.85 | 66.67,49.85 65.41,48.58 51.12,48.58 | 38.42,65.72 49.85,65.72 | 49.85,65.72 49.85,52.39 49.85,49.85 | 51.12,32.7 51.12,33.02 51.12,48.58 | 51.12,48.58 49.85,49.85
VDD  (3 unrouted)
  pour Top (rank 4, no thermals): 30.48,69.22 0.64,69.22 0.64,99.69 30.48,99.69
  pour Top (rank 4, no thermals): 70.48,69.22 70.48,99.69 99.69,99.69 99.69,69.22
  pour Top (rank 4, no thermals): 30.48,29.21 30.48,0.64 0.64,0.64 0.64,29.21
  pour Top (rank 4, no thermals): 70.48,29.21 99.69,29.21 99.69,0.64 70.48,0.64
VSS
  pour Top (no thermals): 31.11,68.58 69.85,68.58 69.85,29.84 31.11,29.84